# Altium schematic sheet 3_LDO.SchDoc
size A4; SheetNumber: 3; SheetTotal: 5
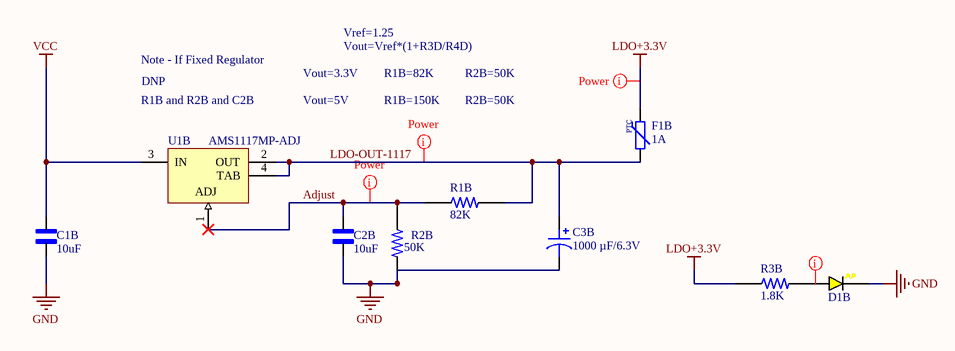
[diagram p0: 3_LDO.SchDoc]

## Parts
C1B  10uF  [C-0603]
C2B  10uF  [C-0603]
C3B  1000 µF/6.3V  [CAP AL TH D8 L3.5 H12.5]
D1B  YELLOW  [LED_0402_YELLOW]  (value not drawn)
F1B  1A  [FUSE_1206]
R1B  82K  [R-0603]
R2B  50K  [R-0603]
R3B  1.8K  [R-0603]
U1B  AMS1117MP-ADJ  [MP04A_N]

## Nets
GND: C1B.1 C2B.1 C3B.2 D1B.K R2B.2
LDO+3.3V: F1B.2 R3B.1
VCC: C1B.2 U1B.3(IN)
Adjust: C2B.2 R1B.1 R2B.1 U1B.1(ADJ)
LDO-OUT-1117: C3B.1 F1B.1 R1B.2 U1B.2(OUT) U1B.4(TAB)
NetD1B_A: D1B.A R3B.2

## Layout directives
net class Power; rule Supply Nets [Voltage = 0.000]: Adjust, LDO+3.3V, LDO-OUT-1117
net class Signal: NetD1B_A

## Notes on the sheet
- Vout=Vref*(1+R3D/R4D)
- Vref=1.25
- Note - If Fixed Regulator
- R1B and R2B and C2B
- DNP
- Vout=3.3V
- Vout=5V
- R1B=82K
- R1B=150K
- R2B=50K
- (in symbol FUSE_PPTC_1206) PTC

## Library data of the parts
C1B C2B = C-0603: Ceramic Capacitor 16V 0603 (1608 Metric); MP: C0603C104J4RAC; MF: KEMET; SnapEDA_Link: https://www.snapeda.com/parts/C0603C104J4RAC/KEMET/view-part/1763758/?ref=snap; Availability: Warning; Package: 0603 KEMET; Check_prices: https://www.snapeda.com/parts/C0603C104J4RAC/KEMET/view-part/1763758/?ref=eda; Value: *; Price: None
C3B = ECA-0JHG102: CAP ALUM 1000UF 20% 6.3V RADIAL; manufacturer: Panasonic Electronic Components; Capacitance: 1000 µF; Lifetime @ Temp.: 1000 Hrs @ 105°C; Polarization: Polar; Ripple Current @ High Frequency: 437 mA @ 100 kHz; Ripple Current @ Low Frequency: 380 mA @ 120 Hz; Part Number: ECA-0JHG102; Applications: General Purpose; componentlink1description: Datasheet; componentlink1url: https://industrial.panasonic.com/cdbs/www-data/pdf/RDF0000/ABA0000C75.pdf; componentlink2description: DigiKey Link; componentlink2url: https://www.digikey.com/en/products/detail/panasonic-electronic-components/ECA-0JHG102/245108; Device Package: Radial, Can; Height - Seated (Max): 0.492" (12.50mm); lastupdated: 27-12-2022 10:20:14 PM; Lead Spacing: 0.138" (3.50mm); Lifecycle Status: Active; Minimum Order: 1; Mounting Type: Through Hole; Operating Temperature: -55°C ~ 105°C; Package / Case: Radial, Can; packaging: Bulk; partid: 7190; Part Status: Active; price: 0.15; series: NHG-A; Size / Dimension: 0.315" Dia (8.00mm); Supplier 1: DigiKey; Supplier Part Number 1: P5509-ND; Tolerance: ±20%; value: 1000 µF/6.3V; Voltage - Rated: 6.3 V
D1B = LED_0402_YELLOW: LED 0402 YELLOW SMD
F1B = FUSE_PPTC_1206: Fuse PPTC SMD 1206; Manufacturer: *; Manufacturer Part Number: *
R1B R2B R3B = R-0603: 0603; MP: 2-1623703-0; Power_Rating: .1 W; Value: 10K; Tolerance: 1%; MF: TE Connectivity; Package: 0603; Price: None; Resistance: 10K; Check_prices: https://www.snapeda.com/parts/2-1623703-0/TE%20Connectivity/view-part/2213192/?ref=eda; SnapEDA_Link: https://www.snapeda.com/parts/2-1623703-0/TE%20Connectivity/view-part/2213192/?ref=snap; Availability: Warning
U1B = CMP-0062-01645-3: 800mA Low-Dropout Linear Regulator, 4-pin SOT-223; PartNumber: LM1117MP-ADJ; Manufacturer: National Semiconductor; High-Reliability: Y; PackageTopMarking: XYTT*N03A; CompType: LDO IC; PowerWise: N; ComponentLink2URL: http://www.national.com/ds/LM/LM1117.pdf; ComponentLink1Description: Manufacturer URL; DatasheetVersion: Apr-2006; PackageReference: MP04A; RoHS: N; ComponentLink3Description: LM1117 Web Page; RevisionNote: SCH symbol layout adjusted; PackageDescription: Molded SOT-223, 6.50 x 3.56 x 1.6mm Body, 4 Lead, 2.3mm Pitch; Code_IPC: SOT223-4; ComponentLink1URL: http://www.national.com/; ComponentLink4Description: MP04A Package Page; ComponentLink3URL: http://www.national.com/pf/LM/LM1117.html; PackageVersion: revB, Apr-2003; ComponentLink2Description: LM1117 Datasheet; PinCount: 4; ComponentLink4URL: http://www.national.com/packaging/folders/mp04a.html; Code_JEDEC: TO-261-AA